# Altium schematic sheet Sandshark 3D - MCU - ATSAM3X8C.SchDoc
size B
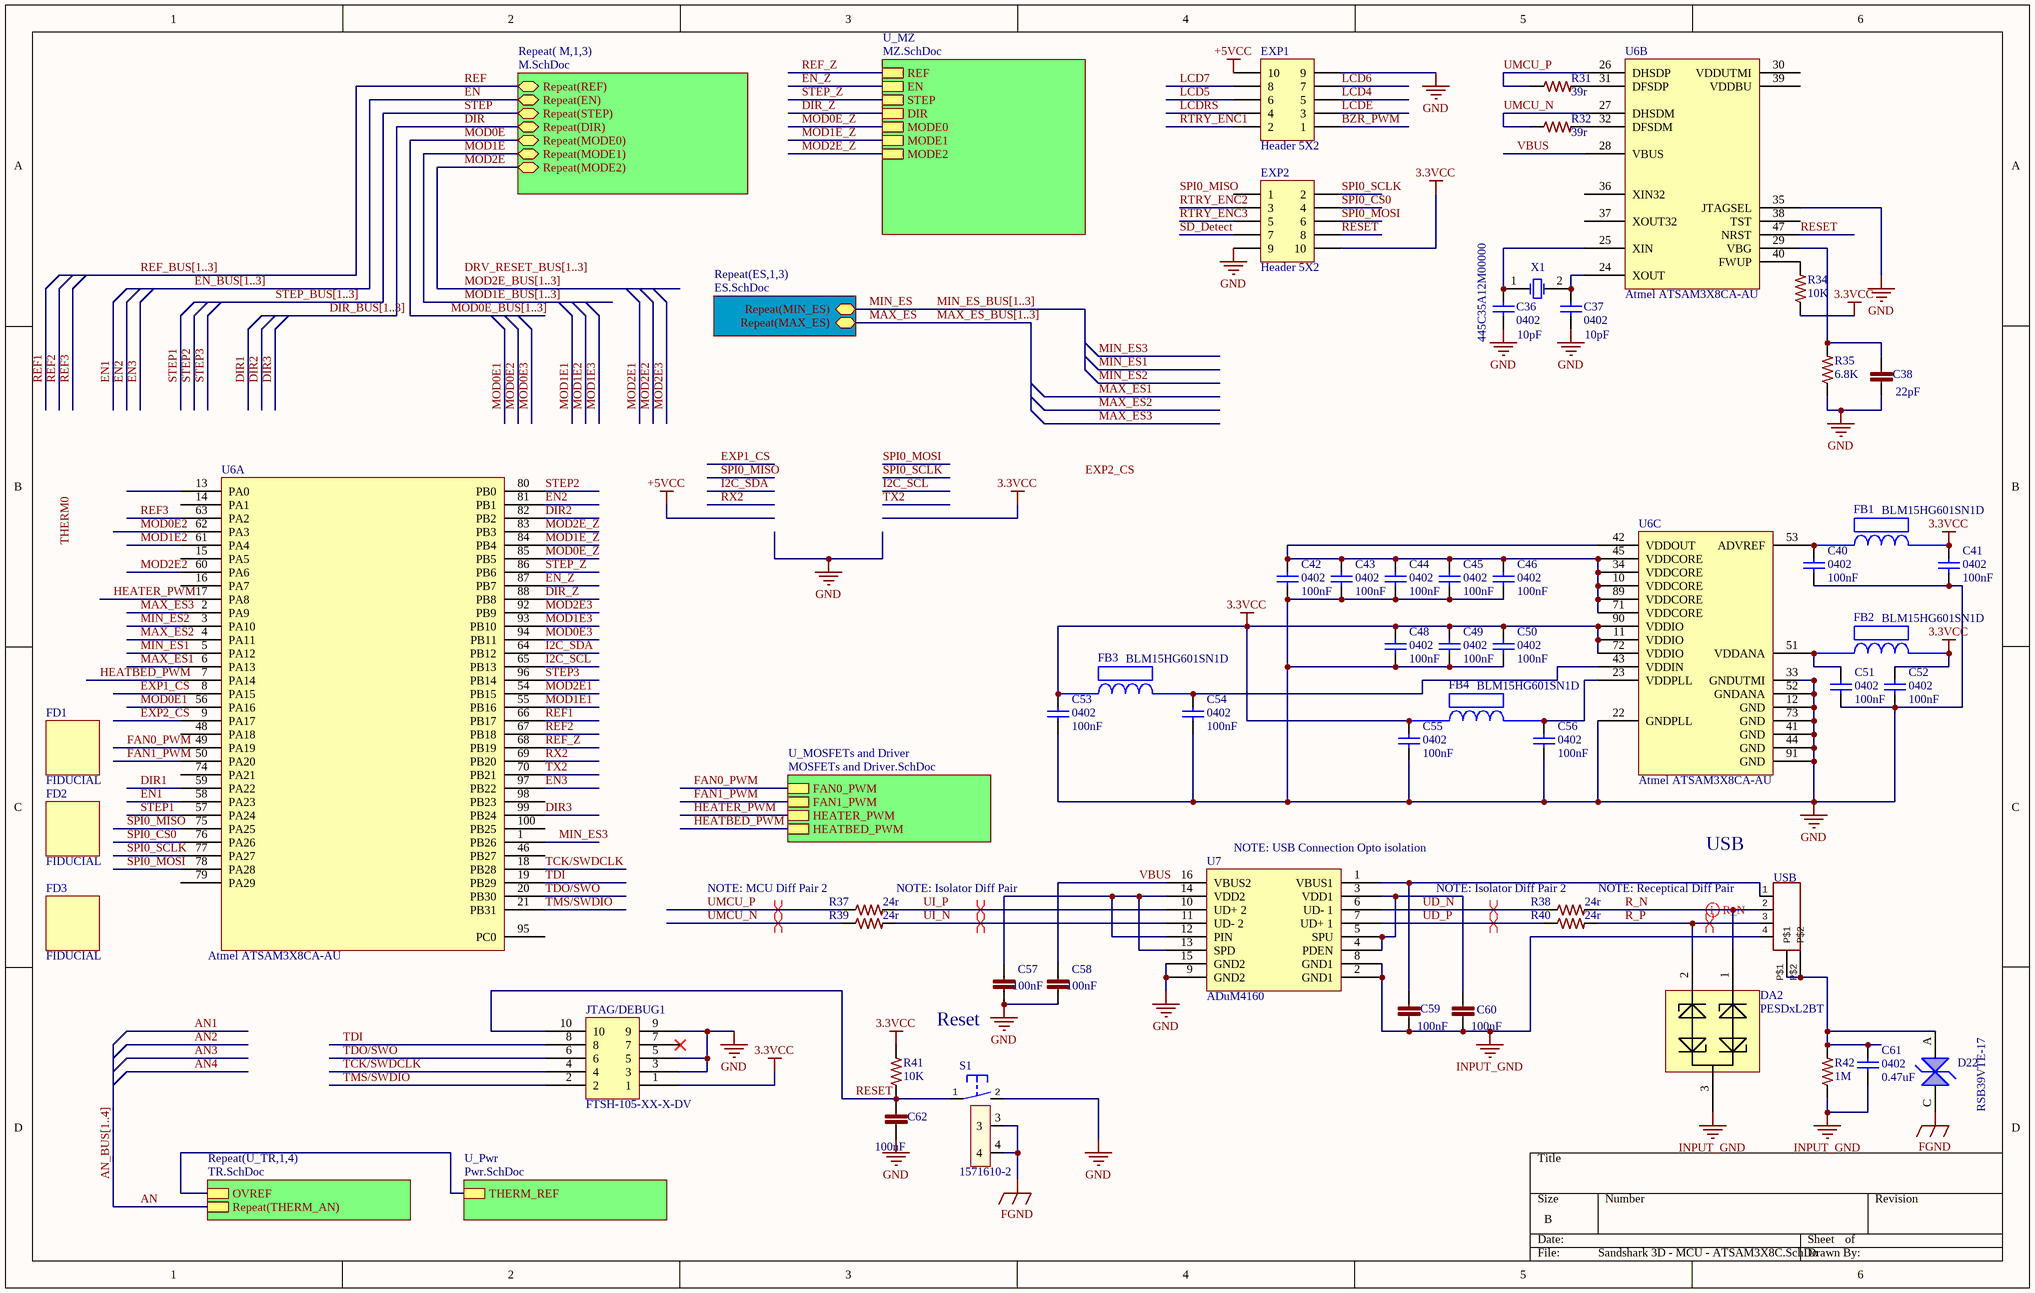
[diagram p0: Sandshark 3D - MCU - ATSAM3X8C.SchDoc]

## Parts
C36  0402  value 10pF  [C0402]
C37  0402  value 10pF  [C0402]
C38  22pF  [C0402]
C40  value 100nF  [C0402]  (hidden comment: 0402)
C41  value 100nF  [C0402]  (hidden comment: 0402)
C42  value 100nF  [C0402]  (hidden comment: 0402)
C43  value 100nF  [C0402]  (hidden comment: 0402)
C44  value 100nF  [C0402]  (hidden comment: 0402)
C45  value 100nF  [C0402]  (hidden comment: 0402)
C46  value 100nF  [C0402]  (hidden comment: 0402)
C48  value 100nF  [C0402]  (hidden comment: 0402)
C49  value 100nF  [C0402]  (hidden comment: 0402)
C50  value 100nF  [C0402]  (hidden comment: 0402)
C51  value 100nF  [C0402]  (hidden comment: 0402)
C52  value 100nF  [C0402]  (hidden comment: 0402)
C53  value 100nF  [C0402]  (hidden comment: 0402)
C54  value 100nF  [C0402]  (hidden comment: 0402)
C55  value 100nF  [C0402]  (hidden comment: 0402)
C56  value 100nF  [C0402]  (hidden comment: 0402)
C57  100nF  [C0402]
C58  100nF  [C0402]
C59  100nF  [C0402]
C60  100nF  [C0402]
C61  value 0.47uF  [C0402]  (hidden comment: 0402)
C62  100nF  [C0402]
D22  RSB39VTE-17  [SOD323-R]
DA2  PESDxL2BT  [SOT95P230X110-3N]
EXP1  Header 5X2  [HDR2X5]
EXP2  Header 5X2  [HDR2X5]
FB1  BLM15HG601SN1D  [BLM18PG121SN1D]
FB2  BLM15HG601SN1D  [BLM18PG121SN1D]
FB3  BLM15HG601SN1D  [BLM18PG121SN1D]
FB4  BLM15HG601SN1D  [BLM18PG121SN1D]
FD1  FIDUCIAL  [FIDUCIAL-1X2]
FD2  FIDUCIAL  [FIDUCIAL-1X2]
FD3  FIDUCIAL  [FIDUCIAL-1X2]
JTAG/DEBUG1  FTSH-105-XX-X-DV  [FTSH-105-XX-X-DV]
R31  39r  [R0402]
R32  39r  [R0402]
R34  10K  [R0603]
R35  6.8K  [R0402]
R37  24r  [R0603]
R38  24r  [R0603]
R39  24r  [R0603]
R40  24r  [R0603]
R41  10K  [R0603]
R42  1M  [R0402]
S1  1571610-2  [B3F-31XX]
U6  Atmel ATSAM3X8CA-AU  [ATSAM3X8CA-AU TQFP100]  (parts A,B,C of 3)
U7  ADuM4160  [ADUM4160BRWZ-RL]
USB  USB-B  [PN61729]  (value not drawn)
X1  445C35A12M00000  [445C35A12M00000]

## Sub-sheets
Repeat( M,1,3) = M.SchDoc: Repeat(REF), Repeat(EN), Repeat(STEP), Repeat(DIR), Repeat(MODE0), Repeat(MODE1), Repeat(MODE2)
Repeat(ES,1,3) = ES.SchDoc: Repeat(MAX_ES), Repeat(MIN_ES)
Repeat(U_TR,1,4) = TR.SchDoc: OVREF, Repeat(THERM_AN)
U_MOSFETs and Driver = MOSFETs and Driver.SchDoc: FAN0_PWM, FAN1_PWM, HEATER_PWM, HEATBED_PWM
U_MZ = MZ.SchDoc: REF, EN, STEP, DIR, MODE0, MODE1, MODE2
U_Pwr = Pwr.SchDoc: THERM_REF

## Nets
3.3VCC: C41.2 C48.2 C49.2 C50.2 C52.2 C53.2 C55.2 EXP2.10 FB1.2 FB2.2 FB3.1 FB4.1 JTAG/DEBUG1.1 R34.1 R41.2 U6.11(VDDIO) U6.72(VDDIO) U6.90(VDDIO)
+5VCC: EXP1.10
FGND: D22.C S1.3 S1.4
GND: C36.1 C37.1 C38.2 C40.1 C41.1 C42.1 C43.1 C44.1 C45.1 C46.1 C48.1 C49.1 C50.1 C51.1 C52.1 C53.1 C54.1 C55.1 C56.1 C57.2 C58.2 C62.2 EXP1.9 EXP2.9 JTAG/DEBUG1.3 JTAG/DEBUG1.5 JTAG/DEBUG1.9 R35.1 S1.2(S) U6.12(GND) U6.22(GNDPLL) U6.33(GNDUTMI) U6.35(JTAGSEL) U6.41(GND) U6.44(GND) U6.52(GNDANA) U6.73(GND) U6.91(GND) U7.9(GND2) U7.15(GND2)
INPUT_GND: C59.2 C60.2 C61.1 DA2.3 R42.1 U7.2(GND1) U7.8(GND1) USB.4
AN: sheet Repeat(U_TR,1,4)/Repeat(THERM_AN)
BZR_PWM: EXP1.1
DIR: sheet Repeat( M,1,3)/Repeat(DIR)
DIR1: U6.59(PA22)
DIR2: U6.82(PB2)
DIR3: U6.99(PB24)
DIR_Z: U6.88(PB8) ; sheet U_MZ/DIR
EN: sheet Repeat( M,1,3)/Repeat(EN)
EN1: U6.58(PA23)
EN2: U6.81(PB1)
EN3: U6.97(PB22)
EN_Z: U6.87(PB7) ; sheet U_MZ/EN
EXP1_CS: U6.8(PA15)
EXP2_CS: U6.9(PA17)
FAN0_PWM: U6.49(PA19) ; sheet U_MOSFETs and Driver/FAN0_PWM
FAN1_PWM: U6.50(PA20) ; sheet U_MOSFETs and Driver/FAN1_PWM
HEATBED_PWM: U6.7(PA14) ; sheet U_MOSFETs and Driver/HEATBED_PWM
HEATER_PWM: U6.17(PA8) ; sheet U_MOSFETs and Driver/HEATER_PWM
I2C_SCL: U6.65(PB13)
I2C_SDA: U6.64(PB12)
LCD4: EXP1.5
LCD5: EXP1.6
LCD6: EXP1.7
LCD7: EXP1.8
LCDE: EXP1.3
LCDRS: EXP1.4
MAX_ES: sheet Repeat(ES,1,3)/Repeat(MAX_ES)
MAX_ES1: U6.6(PA13)
MAX_ES2: U6.4(PA11)
MAX_ES3: U6.2(PA9)
MIN_ES: sheet Repeat(ES,1,3)/Repeat(MIN_ES)
MIN_ES1: U6.5(PA12)
MIN_ES2: U6.3(PA10)
MIN_ES3: U6.1(PB26)
MOD0E: sheet Repeat( M,1,3)/Repeat(MODE0)
MOD0E1: U6.56(PA16)
MOD0E2: U6.62(PA3)
MOD0E3: U6.94(PB11)
MOD0E_Z: U6.85(PB5) ; sheet U_MZ/MODE0
MOD1E: sheet Repeat( M,1,3)/Repeat(MODE1)
MOD1E1: U6.55(PB16)
MOD1E2: U6.61(PA4)
MOD1E3: U6.93(PB10)
MOD1E_Z: U6.84(PB4) ; sheet U_MZ/MODE1
MOD2E: sheet Repeat( M,1,3)/Repeat(MODE2)
MOD2E1: U6.54(PB15)
MOD2E2: U6.60(PA6)
MOD2E3: U6.92(PB9)
MOD2E_Z: U6.83(PB3) ; sheet U_MZ/MODE2
R_N: DA2.1 R38.2 USB.2
R_P: DA2.2 R40.2 USB.3
REF: sheet Repeat( M,1,3)/Repeat(REF)
REF1: U6.66(PB17)
REF2: U6.67(PB18)
REF3: U6.63(PA2)
REF_Z: U6.68(PB19) ; sheet U_MZ/REF
RESET: C62.1 EXP2.8 JTAG/DEBUG1.10 R41.1 S1.1(P) U6.47(NRST)
RTRY_ENC1: EXP1.2
RTRY_ENC2: EXP2.3
RTRY_ENC3: EXP2.5
RX2: U6.69(PB20)
SD_Detect: EXP2.7
SPI0_CS0: EXP2.4 U6.76(PA26)
SPI0_MISO: U6.75(PA25)
SPI0_MOSI: EXP2.6 U6.78(PA28)
SPI0_SCLK: EXP2.2 U6.77(PA27)
STEP: sheet Repeat( M,1,3)/Repeat(STEP)
STEP1: U6.57(PA24)
STEP2: U6.80(PB0)
STEP3: U6.96(PB14)
STEP_Z: U6.86(PB6) ; sheet U_MZ/STEP
TCK/SWDCLK: JTAG/DEBUG1.4 U6.18(PB28)
TDI: JTAG/DEBUG1.8 U6.19(PB29)
TDO/SWO: JTAG/DEBUG1.6 U6.20(PB30)
TMS/SWDIO: JTAG/DEBUG1.2 U6.21(PB31)
TX2: U6.70(PB21)
UD_N: R38.1 U7.6(UD-_1)
UD_P: R40.1 U7.7(UD+_1)
UI_N: R39.2 U7.11(UD-_2)
UI_P: R37.2 U7.10(UD+_2)
UMCU_N: R32.1 R39.1 U6.27(DHSDM)
UMCU_P: R31.1 R37.1 U6.26(DHSDP)
VBUS: C58.1 U6.28(VBUS) U7.16(VBUS2)
NetC36_2: C36.2 U6.25(XIN) X1.1(OSC1)
NetC37_2: C37.2 U6.24(XOUT) X1.2(OSC2)
NetC38_1: C38.1 R35.2 U6.29(VBG)
NetC40_2: C40.2 FB1.1 U6.53(ADVREF)
NetC42_2: C42.2 C43.2 C44.2 C45.2 C46.2 U6.10(VDDCORE) U6.34(VDDCORE) U6.42(VDDOUT) U6.45(VDDCORE) U6.71(VDDCORE) U6.89(VDDCORE)
NetC51_2: C51.2 FB2.1 U6.51(VDDANA)
NetC54_2: C54.2 FB3.2 U6.43(VDDIN)
NetC56_2: C56.2 FB4.2 U6.23(VDDPLL)
NetC57_1: C57.1 U7.12(PIN) U7.13(SPD) U7.14(VDD2)
NetC59_1: C59.1 U7.1(VBUS1) USB.1
NetC60_1: C60.1 U7.3(VDD1) U7.4(PDEN) U7.5(SPU)
NetC61_2: C61.2 D22.A R42.2 USB.P$1 USB.P$2
NetR31_2: R31.2 U6.31(DFSDP)
NetR32_2: R32.2 U6.32(DFSDM)
NetR34_2: R34.2 U6.40(FWUP)
(unnamed): sheet Repeat(U_TR,1,4)/OVREF, sheet U_Pwr/THERM_REF

Not connected (* = marked no-connect by the designer): EXP2 1; JTAG/DEBUG1 7*; U6 13(PA0) 14(PA1) 15(PA5) 16(PA7) 30(VDDUTMI) 36(XIN32) 37(XOUT32) 38(TST) 39(VDDBU) 46(PB27) 48(PA18) 74(PA21) 79(PA29) 95(PC0) 98(PB23) 100(PB25)

## Buses and harness runs
bus AN_BUS[1..4]
bus DIR_BUS[1..3]
bus DRV_RESET_BUS[1..3]
bus EN_BUS[1..3]
bus MAX_ES_BUS[1..3]
bus MIN_ES_BUS[1..3]
bus MOD0E_BUS[1..3]
bus MOD1E_BUS[1..3]
bus MOD2E_BUS[1..3]
bus REF_BUS[1..3]
bus STEP_BUS[1..3]

## Layout directives
differential pair: R_N, R_P, UD_N, UD_P, UI_N, UI_P, UMCU_N, UMCU_P

## Notes on the sheet
- NOTE: MCU Diff Pair 2
- NOTE: Isolator Diff Pair
- (near U7) NOTE: USB Connection Opto isolation
- (near R38) NOTE: Isolator Diff Pair 2
- NOTE: Receptical Diff Pair
- USB
- (near C57) Reset
- Labels drawn without touching a wire or pin: DRV_RESET_BUS[1..3], EXP2_CS, SPI0_MISO, THERM0

## Library data of the parts
C36 C37 = CL05C100JB5NNNC: CAP CER 10PF 50V 5% NP0 0402; MFR: Samsung; Tolerance: 10%; Voltage: 50VDC; Published: 10 - Dec - 2014; LatestRevisionDate: 10 - Dec - 2014; LatestRevisionNote: Ultimachine Footprint Added; Publisher: Ultimachine; Component Type: Chip Capacitor; MFR Part #: CL05C100JB5NNNC; Part Description: CAP CER 10PF 50V 5% NP0 0402; Mounting Type: SMT 0402; Datasheet: http://www.samsungsem.com/kr/front/downloadcms.do?path=/kr/support/product-search/mlcc/__icsFiles/afieldfile/2014/11/05&fileName=S_CL05C100JB5NNNC.pdf; Height: 0.55mm; PackageReference: 0402
C38 = 04025A220JAT2A: CAP CER 0402 22pF 50V 5% C0G; LastRevisionNote: ImportComponents; Published: 23-Apr-2014; Publisher: UltiMachine; LastRevisionDate: 23-Apr-2014; ManufacturerPartNumber: 04025A220JAT2A; VALUE: 22pF
C40-C46 C48-C56 = GRM155R71C104KA88D: CAP CER 0.1UF (100nF) 16V 10% X7R 0402; MFR: Murata; Part Description: CAP CER 0.1UF 16V 10% X7R 0402; Published: 10 - Dec - 2014; LatestRevisionDate: 10 - Dec - 2014; LatestRevisionNote: Ultimachine Footprint Added; Publisher: Ultimachine; Component Type: Chip Capacitor; MFR Part #: GRM155R71C104KA88D; Mounting Type: SMT 0402; Datasheet: http://psearch.murata.com/capacitor/product/GRM155R71C104KA88%23.pdf; Height: 0.5 ±0.05mm; Tolerance: 10%; Voltage: 16v; PackageReference: 0402
C57-C60 C62 = GRM155R71C104KA88D: CAP CER 0402 100nF 16V 10% X7R; LastRevisionNote: ImportComponents; Published: 23-Apr-2014; Publisher: UltiMachine; LastRevisionDate: 23-Apr-2014; ManufacturerPartNumber: GRM155R71C104KA88D; VALUE: 100nF
C61 = GRM155R60J474KE19D: 0.47uF 6.3v C0402 - GRM155R60J474KE19D; MFR: Murata; Part Description: CAP CER 0.47UF 6.3V 10% X5R 0402; Tolerance: 10%; Voltage: 6.3VDC; Published: 10 - Dec - 2014; LatestRevisionDate: 10 - Dec - 2014; LatestRevisionNote: Ultimachine Footprint Added; Publisher: Ultimachine; Component Type: Chip Capacitor; MFR Part #: GRM155R60J474KE19D; Mounting Type: SMT 0402; Datasheet: http://search.murata.co.jp/Ceramy/image/img/A01X/G101/ENG/GRM155R60J474KE19-01.pdf; Height: 0.5 ±0.05mm; PackageReference: 0402
D22 = RSB39VTE-17: DIODE TVS
DA2 = PESDxL2BT: PESDxL2BT TVS Diode Array 2x
EXP1 EXP2 = Header 5X2: Header, 5-Pin, Dual row; LatestRevisionDate: 17-Jul-2002; LatestRevisionNote: Re-released for DXP Platform.; Publisher: Altium Limited
JTAG/DEBUG1 = ARM Cortex JTAG-DEBUG Header
R31 R32 = ERJ-2RKF39R0X: RES SMD 39 OHM 1% 1/10W 0402; Manufacturer: Panasonic; LastRevisionNote: ImportComponents; Published: 23-Apr-2014; Publisher: UltiMachine; LastRevisionDate: 23-Apr-2014; ManufacturerPartNumber: ERJ-2RKF39R0X; Height: 0.4mm; VALUE: 39r
R34 R41 = ERJ-3EKF1002V: RES 0603 10K 100mW 1%; LastRevisionNote: ImportComponents; Published: 23-Apr-2014; Publisher: UltiMachine; LastRevisionDate: 23-Apr-2014; ManufacturerPartNumber: ERJ-3EKF1002V; VALUE: 10K
R35 = CRCW04026K80FKED: RES SMD 6.8K OHM 1% 1/16W 0402; Manufacturer: Vishay Dale; LastRevisionNote: ImportComponents; Published: 23-Apr-2014; Publisher: UltiMachine; LastRevisionDate: 23-Apr-2014; ManufacturerPartNumber: CRCW04026K80FKED; Height: 0.4mm; VALUE: 6.8K
R37-R40 = RC1608F240CS: RES SMD 24 OHM 1% 1/10W 0603; Manufacturer: Samsung; ManufacturerPartNumber: RC0603FR-07100KL; LastRevisionNote: ImportComponents; Published: 23-Apr-2014; Publisher: UltiMachine; LastRevisionDate: 23-Apr-2014; VALUE: 24r; PDF: http://www.samsungsem.com/global/support/library/product-catalog/__icsFiles/afieldfile/2015/01/12/CHIP_RESISTOR_150112_1.pdf
R42 = ERJ2GEJ105X: RES 0402 1M 100mW 5%; LastRevisionNote: ImportComponents; Published: 23-Apr-2014; Publisher: UltiMachine; LastRevisionDate: 23-Apr-2014; ManufacturerPartNumber: ERJ2GEJ105X; VALUE: 1M
S1 = 1571610-2_1: SWTCH Momentary Washable; Manufacturer: Omron; Manufacturer: TE; LastRevisionNote: Import; ComponentLink1URL: http://www.te.com/commerce/DocumentDelivery/DDEController?Action=srchrtrv&DocNm=1571610&DocType=Customer+Drawing&DocLang=English; ComponentLink1Description: Datasheet for B3F-31XX; Published: 23-Apr-2014; Publisher: UltiMachine; LastRevisionDate: 23-Apr-2014; ManufacturerPartNumber: 1571610-2; Supplier 1: Mouser; Supplier Part Number 1: 506-1571610-2
U6 = ATML-ATSAM3X8CA-AU-LQFP-100: Atmel ARM Cortex M3 MCU ATSAM3X8CA-AU; Manufacture: Atmel; Manufacture Part #: ATSAM3X8CA-AU; Type: ARM Cortex M3 Microcontroller; Mounting Type: SMT TQFP; Package Type: TQFP100; Datasheet: http://www.atmel.com/Images/doc11057s.pdf
U7 = ADuM4160: ADI iCoupler - USB 2.0 Galvanic Isolator
USB = USB-B: USB connector B PTH; LastRevisionNote: ImportComponents; Published: 23-Apr-2014; Publisher: UltiMachine; LastRevisionDate: 23-Apr-2014
X1 = XTAL: Crystal Oscillator; Published: 8-Jun-2000; LatestRevisionDate: 17-Jul-2002; LatestRevisionNote: Re-released for DXP Platform.; PackageReference: R38; Publisher: Altium Limited; PackageDescription: Crystal, Thru-Hole; 2 Leads; Body 3.1 x 8.2 mm (Dia.xH)